# Altium schematic sheet Power_main_DCDC.SchDoc: =DocumentName
size A3; DocumentNumber: 1; Revision: 0; SheetNumber: 4; SheetTotal: 20; Last modified by: Krzysztof Belewicz
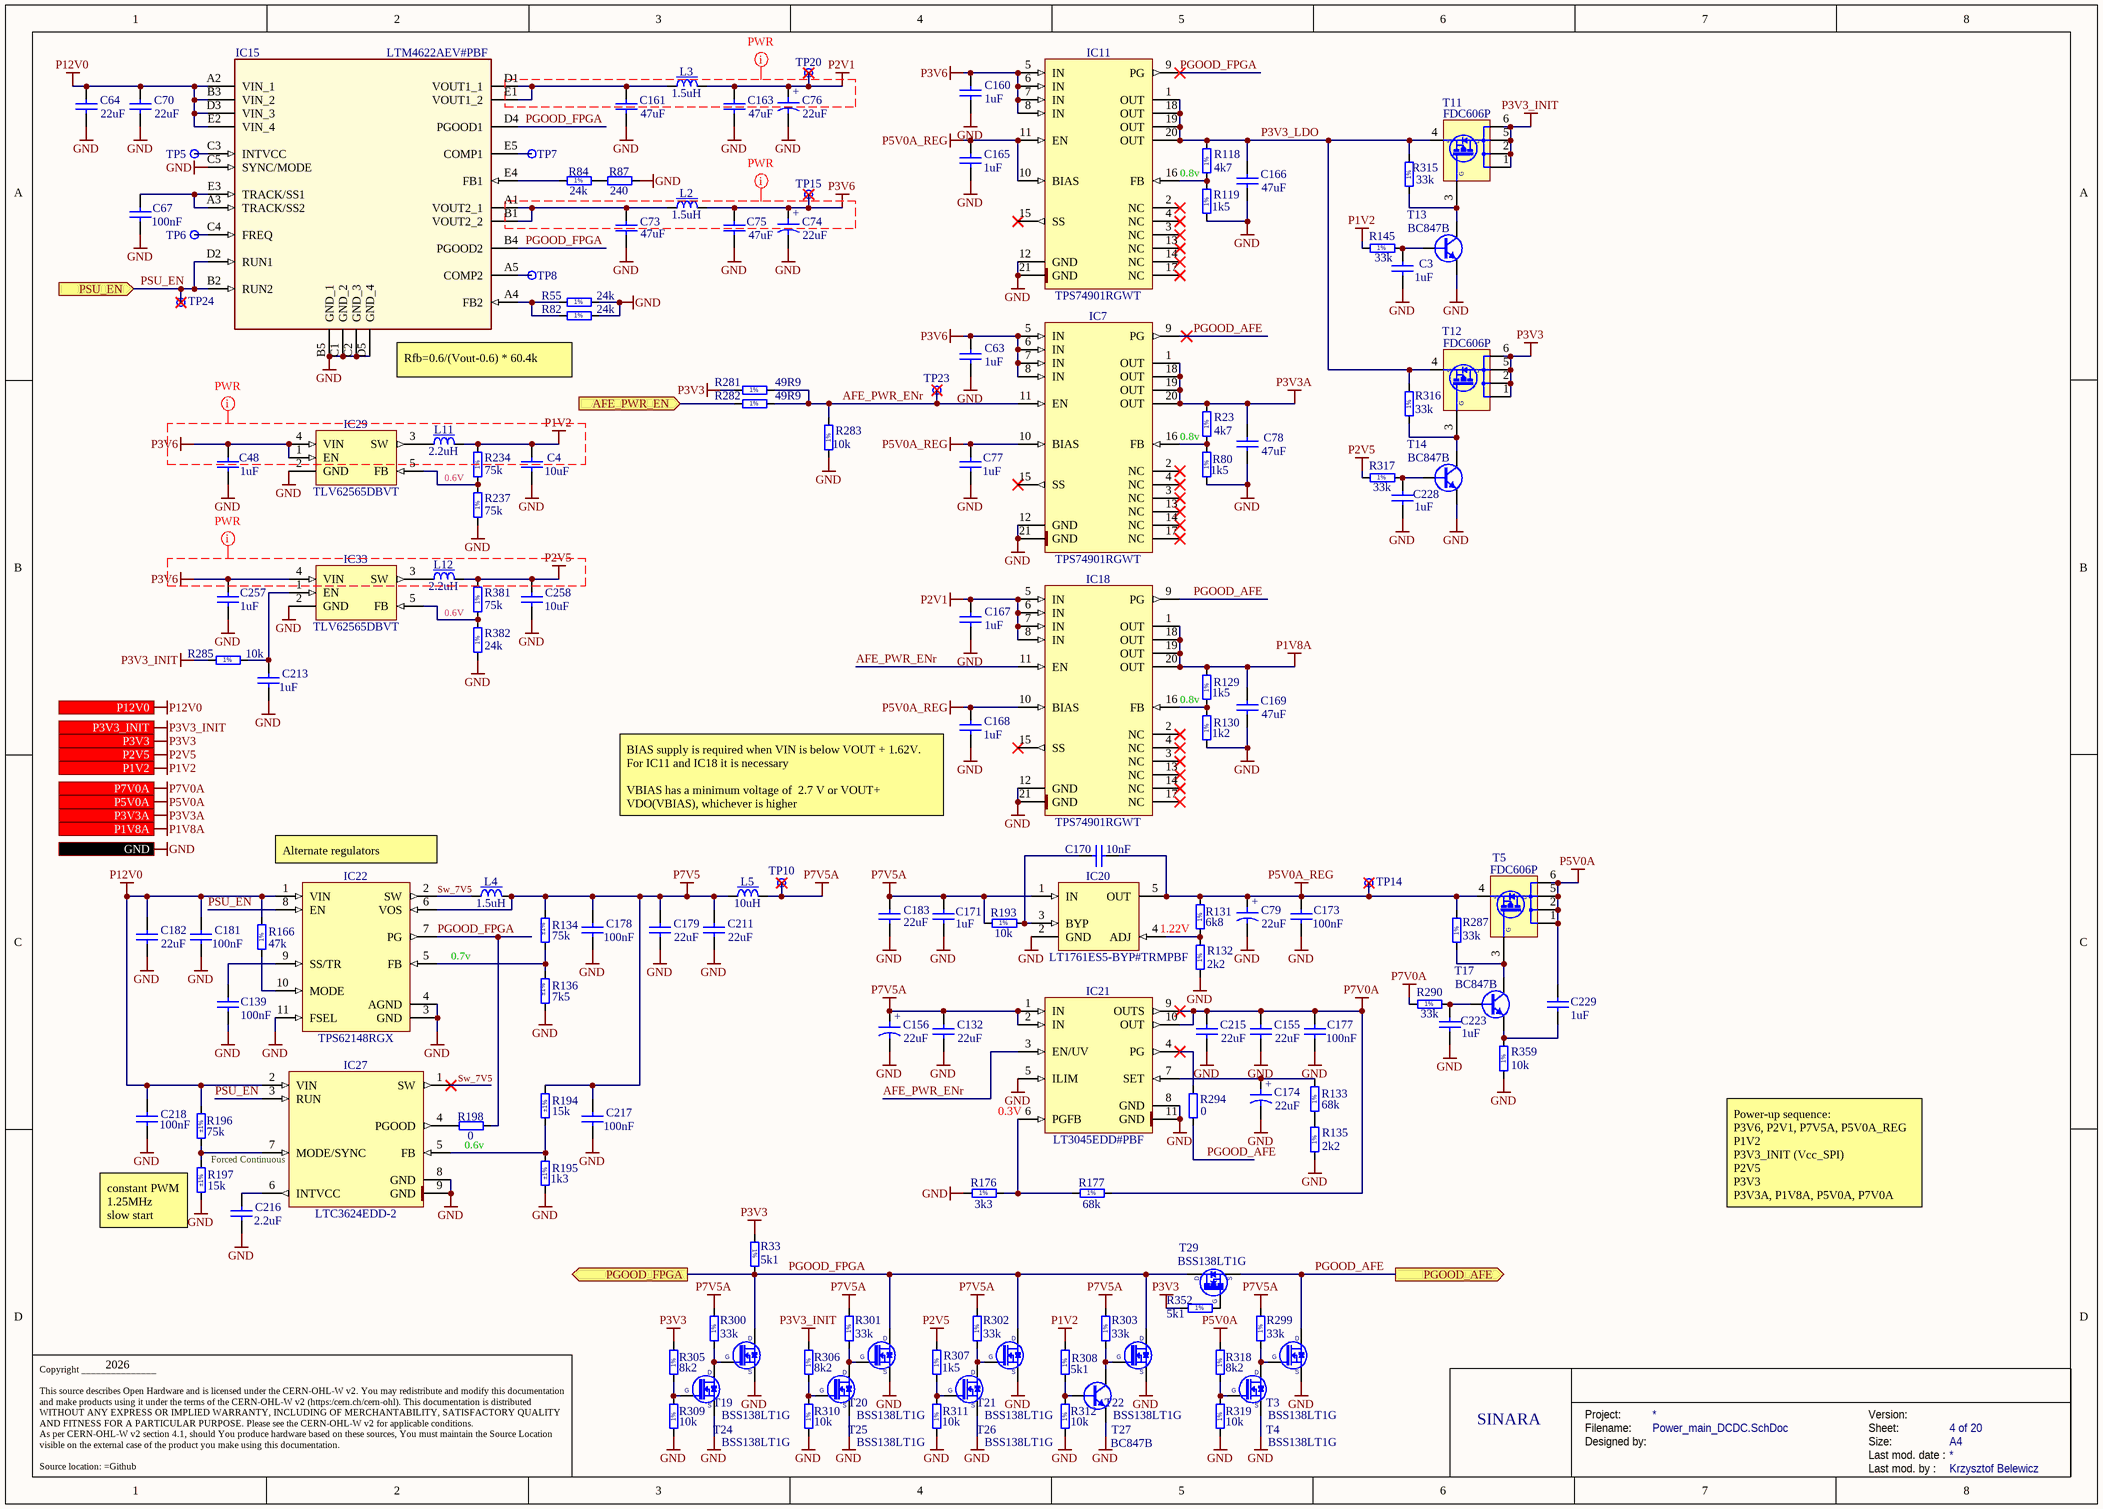
[diagram p0: Power_main_DCDC.SchDoc]

## Parts
C3  1uF  [CAPC1608X87N]
C4  10uF  [CAPC2012X135N]
C48  1uF  [CAPC1005X55N]
C63  1uF  [CAPC1005X55N]
C64  22uF  [CAPC2012X135N]
C67  100nF  [CAPC1005X55N]
C70  22uF  [CAPC2012X135N]
C73  47uF  [CAPC3225X270N]
C74  22uF  [CAPMP3528X210N]
C75  47uF  [CAPC3225X270N]
C76  22uF  [CAPMP3528X210N]
C77  1uF  [CAPC1005X55N]
C78  47uF  [CAPC3225X270N]
C79  22uF  [CAPMP3528X210N]
C132  22uF  [CAPC2012X135N]
C139  100nF  [CAPC1005X55N]
C155  22uF  [CAPC2012X135N]
C156  22uF  [CAPMP3528X210N]
C160  1uF  [CAPC1005X55N]
C161  47uF  [CAPC3225X270N]
C163  47uF  [CAPC3225X270N]
C165  1uF  [CAPC1005X55N]
C166  47uF  [CAPC3225X270N]
C167  1uF  [CAPC1005X55N]
C168  1uF  [CAPC1005X55N]
C169  47uF  [CAPC3225X270N]
C170  10nF  [CAPC1005X55N]
C171  1uF  [CAPC1005X55N]
C173  100nF  [CAPC1005X55N]
C174  22uF  [CAPMP3528X210N]
C177  100nF  [CAPC1005X55N]
C178  100nF  [CAPC1005X55N]
C179  22uF  [CAPC2012X135N]
C181  100nF  [CAPC1005X55N]
C182  22uF  [CAPC2012X135N]
C183  22uF  [CAPC2012X135N]
C211  22uF  [CAPC2012X135N]
C213  1uF  [CAPC1608X87N]
C215  22uF  [CAPC2012X135N]
C216  2.2uF  [CAPC1005X55N]
C217  100nF  [CAPC1005X55N]
C218  100nF  [CAPC1005X55N]
C223  1uF  [CAPC1608X87N]
C228  1uF  [CAPC1608X87N]
C229  1uF  [CAPC1005X55N]
C257  1uF  [CAPC1005X55N]
C258  10uF  [CAPC2012X135N]
IC7  TPS74901RGWT  [QFN65P500X500X100-21N-S325]
IC11  TPS74901RGWT  [QFN65P500X500X100-21N-S325]
IC15  LTM4622AEV#PBF  [LGA25C127P5X5_625X625X190]
IC18  TPS74901RGWT  [QFN65P500X500X100-21N-S325]
IC20  LT1761ES5-BYP#TRMPBF  [SOT95P280X100-5N]
IC21  LT3045EDD#PBF  [SON50P300X300X80-11N-R175X248]
IC22  TPS62148RGX  [TEXAS_RGX0011A]
IC27  LTC3624EDD-2  [SON50P300X300X80-9N-R175X248]
IC29  TLV62565DBVT  [SOT95P280X145-5N]
IC33  TLV62565DBVT  [SOT95P280X145-5N]
L2  1.5uH  [IND_TDK_SPM6530]
L3  1.5uH  [IND_TDK_SPM6530]
L4  1.5uH  [IND_TDK_SPM6530]
L5  10uH  [IND_MURATA-PS_8400]
L11  2.2uH  [IND_MURATA_LQH44PN_P0]
L12  2.2uH  [IND_MURATA_LQH44PN_P0]
R23  4k7  [RESC1005X40N]
R33  5k1  [RESC1005X40N]
R55  24k  [RESC1005X40N]
R80  1k5  [RESC1608X55N]
R82  24k  [RESC1005X40N]
R84  24k  [RESC1005X40N]
R87  240  [RESC1005X40N]
R118  4k7  [RESC1005X40N]
R119  1k5  [RESC1608X55N]
R129  1k5  [RESC1608X55N]
R130  1k2  [RESC1608X55N]
R131  6k8  [RESC1608X55N]
R132  2k2  [RESC1005X40N]
R133  68k  [RESC1005X40N]
R134  75k  Tolerance: ±1%  [RESC1608X55N]
R135  2k2  [RESC1005X40N]
R136  7k5  Tolerance: ±1%  [RESC1608X55N]
R145  33k  [RESC1005X40N]
R166  47k  [RESC1608X55N]
R176  3k3  [RESC1608X55N]
R177  68k  [RESC1005X40N]
R193  10k  [RESC1005X40N]
R194  15k  Tolerance: ±1%  [RESC1005X40N]
R195  1k3  Tolerance: ±1%  [RESC1005X40N]
R196  75k  Tolerance: ±1%  [RESC1005X40N]
R197  15k  Tolerance: ±1%  [RESC1005X40N]
R198  0  [RESC1005X40N]
R234  75k  [RESC1005X40N]
R237  75k  [RESC1005X40N]
R281  49R9  [RESC1005X40N]
R282  49R9  [RESC1005X40N]
R283  10k  [RESC1005X40N]
R285  10k  [RESC1005X40N]
R287  33k  [RESC1005X40N]
R290  33k  [RESC1005X40N]
R294  0  [RESC1005X40N]
R299  33k  [RESC1005X40N]
R300  33k  [RESC1005X40N]
R301  33k  [RESC1005X40N]
R302  33k  [RESC1005X40N]
R303  33k  [RESC1005X40N]
R305  8k2  [RESC1005X40N]
R306  8k2  [RESC1005X40N]
R307  1k5  [RESC1608X55N]
R308  5k1  [RESC1005X40N]
R309  10k  [RESC1005X40N]
R310  10k  [RESC1005X40N]
R311  10k  [RESC1005X40N]
R312  10k  [RESC1005X40N]
R315  33k  [RESC1005X40N]
R316  33k  [RESC1005X40N]
R317  33k  [RESC1005X40N]
R318  8k2  [RESC1005X40N]
R319  10k  [RESC1005X40N]
R352  5k1  [RESC1005X40N]
R359  10k  [RESC1005X40N]
R381  75k  [RESC1005X40N]
R382  24k  [RESC1005X40N]
T3  BSS138LT1G  [SOT95P240X110-3N]
T4  BSS138LT1G  [SOT95P240X110-3N]
T5  FDC606P  [SOT95P275X110-6N]
T11  FDC606P  [SOT95P275X110-6N]
T12  FDC606P  [SOT95P275X110-6N]
T13  BC847B  [SOT95P230X110-3N]
T14  BC847B  [SOT95P230X110-3N]
T17  BC847B  [SOT95P230X110-3N]
T19  BSS138LT1G  [SOT95P240X110-3N]
T20  BSS138LT1G  [SOT95P240X110-3N]
T21  BSS138LT1G  [SOT95P240X110-3N]
T22  BSS138LT1G  [SOT95P240X110-3N]
T24  BSS138LT1G  [SOT95P240X110-3N]
T25  BSS138LT1G  [SOT95P240X110-3N]
T26  BSS138LT1G  [SOT95P240X110-3N]
T27  BC847B  [SOT95P230X110-3N]
T29  BSS138LT1G  [SOT95P240X110-3N]
TP5  Test Point  [TPS127]  (value not drawn)  (no BOM)
TP6  Test Point  [TPS127]  (value not drawn)  (no BOM)
TP7  Test Point  [TPS127]  (value not drawn)  (no BOM)
TP8  Test Point  [TPS127]  (value not drawn)  (no BOM)
TP10  Test Point  [TPS127]  (value not drawn)  (no BOM)
TP14  Test Point  [TPS127]  (value not drawn)  (no BOM)
TP15  Test Point  [TPS127]  (value not drawn)  (no BOM)
TP20  Test Point  [TPS127]  (value not drawn)  (no BOM)
TP23  Test Point  [TPS127]  (value not drawn)  (no BOM)
TP24  Test Point  [TPS127]  (value not drawn)  (no BOM)

## Ports
AFE_PWR_EN (in), GND, P1V2 (out), P1V8A (out), P2V5 (out), P3V3 (out), P3V3_INIT (out), P3V3A (out), P5V0A (out), P7V0A (out), P12V0 (in), PGOOD_AFE (out), PGOOD_FPGA (out), PSU_EN (in)

## Nets
GND: C3.1 C4.2 C48.1 C63.2 C64.1 C67.1 C70.1 C73.1 C74.2 C75.1 C76.2 C77.1 C78.1 C79.2 C132.1 C139.2 C155.1 C156.2 C160.2 C161.1 C163.1 C165.1 C166.1 C167.2 C168.1 C169.1 C171.1 C173.1 C174.2 C177.1 C178.1 C179.1 C181.1 C182.1 C183.1 C211.1 C213.1 C215.1 C216.1 C217.1 C218.1 C223.1 C228.1 C257.1 C258.2 IC7.12(GND) IC7.21(GND) IC11.12(GND) IC11.21(GND) IC15.B5(GND_1) IC15.C1(GND_2) IC15.C2(GND_3) IC15.C5(SYNC/MODE) IC15.D5(GND_4) IC18.12(GND) IC18.21(GND) IC20.2(GND) IC21.5(ILIM) IC21.8(GND) IC21.11(GND) IC22.3(GND) IC22.4(AGND) IC22.11(FSEL) IC27.8(GND) IC27.9(GND) IC29.2(GND) IC33.2(GND) R55.2 R80.1 R82.2 R87.1 R119.1 R130.1 R132.1 R135.1 R136.1 R176.1 R195.1 R197.1 R237.1 R283.1 R309.1 R310.1 R311.1 R312.1 R319.1 R359.1 R382.1 T3.2(S) T4.2(S) T13.2(E) T14.2(E) T19.2(S) T20.2(S) T21.2(S) T22.2(S) T24.2(S) T25.2(S) T26.2(S) T27.2(E) ; port GND
P1V2: C4.1 L11.2 R145.1 R234.2 R308.2 ; port P1V2
P1V8A: C169.2 IC18.1(OUT) IC18.18(OUT) IC18.19(OUT) IC18.20(OUT) R129.2 ; port P1V8A
P2V1: C76.1 C163.2 C167.1 IC18.5(IN) IC18.6(IN) IC18.7(IN) IC18.8(IN) L3.2 TP20.1
P2V5: C258.1 L12.2 R307.2 R317.1 R381.2 ; port P2V5
P3V3: R33.1 R281.1 R305.2 R352.1 T12.1(D) T12.2(D) T12.5(D) T12.6(D) ; port P3V3
P3V3_INIT: R285.1 R306.2 T11.1(D) T11.2(D) T11.5(D) T11.6(D) ; port P3V3_INIT
P3V3A: C78.2 IC7.1(OUT) IC7.18(OUT) IC7.19(OUT) IC7.20(OUT) R23.2 ; port P3V3A
P3V6: C48.2 C63.1 C74.1 C75.2 C160.1 C257.2 IC7.5(IN) IC7.6(IN) IC7.7(IN) IC7.8(IN) IC11.5(IN) IC11.6(IN) IC11.7(IN) IC11.8(IN) IC29.1(EN) IC29.4(VIN) IC33.4(VIN) L2.2 TP15.1
P5V0A: C229.1 R318.2 T5.1(D) T5.2(D) T5.5(D) T5.6(D) ; port P5V0A
P5V0A_REG: C77.2 C79.1 C165.2 C168.2 C170.2 C173.2 IC7.10(BIAS) IC11.10(BIAS) IC11.11(EN) IC18.10(BIAS) IC20.5(OUT) R131.2 R287.2 T5.4(S) TP14.1
P7V0A: C155.2 C177.2 C215.2 IC21.9(OUTS) IC21.10(OUT) R177.2 R290.1 ; port P7V0A
P7V5: C178.2 C179.2 C211.2 C217.2 IC22.6(VOS) L4.2 L5.1 R134.2 R194.2
P7V5A: C132.2 C156.1 C171.2 C183.2 IC20.1(IN) IC21.1(IN) IC21.2(IN) L5.2 R193.1 R299.2 R300.2 R301.2 R302.2 R303.2 TP10.1
P12V0: C64.2 C70.2 C181.2 C182.2 C218.2 IC15.A2(VIN_1) IC15.B3(VIN_2) IC15.D3(VIN_3) IC15.E2(VIN_4) IC22.1(VIN) IC27.2(VIN) R166.2 R196.2 ; port P12V0
AFE_PWR_EN: R282.1 ; port AFE_PWR_EN
AFE_PWR_ENr: IC7.11(EN) IC18.11(EN) IC21.3(EN/UV) R281.2 R282.2 R283.2 TP23.1
P3V3_LDO: C166.2 IC11.1(OUT) IC11.18(OUT) IC11.19(OUT) IC11.20(OUT) R118.2 R315.2 R316.2 T11.4(S) T12.4(S)
PGOOD_AFE: IC7.9(PG) IC18.9(PG) R294.1 T3.3(D) T29.2(S) ; port PGOOD_AFE
PGOOD_FPGA: IC11.9(PG) IC15.B4(PGOOD2) IC15.D4(PGOOD1) IC22.7(PG) R33.2 R198.2 T19.3(D) T20.3(D) T21.3(D) T22.3(D) T29.3(D) ; port PGOOD_FPGA
PSU_EN: IC15.B2(RUN2) IC15.D2(RUN1) IC22.8(EN) IC27.3(RUN) TP24.1 ; port PSU_EN
Sw_7V5: IC22.2(SW) IC27.1(SW) L4.1
NetC3_2: C3.2 R145.2 T13.1(B)
NetC67_2: C67.2 IC15.A3(TRACK/SS2) IC15.E3(TRACK/SS1)
NetC73_2: C73.2 IC15.A1(VOUT2_1) IC15.B1(VOUT2_2) L2.1
NetC139_1: C139.1 IC22.9(SS/TR)
NetC161_2: C161.2 IC15.D1(VOUT1_1) IC15.E1(VOUT1_2) L3.1
NetC170_1: C170.1 IC20.3(BYP) R193.2
NetC174_1: C174.1 IC21.7(SET) R133.2
NetC213_2: C213.2 IC33.1(EN) R285.2
NetC216_2: C216.2 IC27.6(INTVCC)
NetC223_2: C223.2 R290.2 T17.1(B)
NetC228_2: C228.2 R317.2 T14.1(B)
NetC229_2: C229.2 R359.2 T17.2(E)
NetIC7_16: IC7.16(FB) R23.1 R80.2
NetIC11_16: IC11.16(FB) R118.1 R119.2
NetIC15_A4: IC15.A4(FB2) R55.1 R82.1
NetIC15_A5: IC15.A5(COMP2) TP8.1
NetIC15_C3: IC15.C3(INTVCC) TP5.1
NetIC15_C4: IC15.C4(FREQ) TP6.1
NetIC15_E4: IC15.E4(FB1) R84.1
NetIC15_E5: IC15.E5(COMP1) TP7.1
NetIC18_16: IC18.16(FB) R129.1 R130.2
NetIC20_4: IC20.4(ADJ) R131.1 R132.2
NetIC21_4: IC21.4(PG) R294.2
NetIC21_6: IC21.6(PGFB) R176.2 R177.1
NetIC22_5: IC22.5(FB) R134.1 R136.2
NetIC22_10: IC22.10(MODE) R166.1
NetIC27_4: IC27.4(PGOOD) R198.1
NetIC27_5: IC27.5(FB) R194.1 R195.2
NetIC27_7: IC27.7(MODE/SYNC) R196.1 R197.2
NetIC29_3: IC29.3(SW) L11.1
NetIC29_5: IC29.5(FB) R234.1 R237.2
NetIC33_3: IC33.3(SW) L12.1
NetIC33_5: IC33.5(FB) R381.1 R382.2
NetR84_2: R84.2 R87.2
NetR133_1: R133.1 R135.2
NetR287_1: R287.1 T5.3(S) T17.3(C)
NetR299_1: R299.1 T3.1(G) T4.3(D)
NetR300_1: R300.1 T19.1(G) T24.3(D)
NetR301_1: R301.1 T20.1(G) T25.3(D)
NetR302_1: R302.1 T21.1(G) T26.3(D)
NetR303_1: R303.1 T22.1(G) T27.3(C)
NetR305_1: R305.1 R309.2 T24.1(G)
NetR306_1: R306.1 R310.2 T25.1(G)
NetR307_1: R307.1 R311.2 T26.1(G)
NetR308_1: R308.1 R312.2 T27.1(B)
NetR315_1: R315.1 T11.3(S) T13.3(C)
NetR316_1: R316.1 T12.3(S) T14.3(C)
NetR318_1: R318.1 R319.2 T4.1(G)
NetR352_2: R352.2 T29.1(G)

Not connected (* = marked no-connect by the designer): IC7 2(NC)* 3(NC)* 4(NC)* 13(NC)* 14(NC)* 15(SS)* 17(NC)*; IC11 2(NC)* 3(NC)* 4(NC)* 13(NC)* 14(NC)* 15(SS)* 17(NC)*; IC18 2(NC)* 3(NC)* 4(NC)* 13(NC)* 14(NC)* 15(SS)* 17(NC)*

## Layout directives
net class PWR: P1V2, P2V1, P2V5, P3V6

## Notes on the sheet
- 0.8v
- (near IC15) Rfb=0.6/(Vout-0.6) * 60.4k
- 0.6V
- (near IC22) Alternate regulators
- (near C168) BIAS supply is required when VIN is below VOUT + 1.62V.
  For IC11 and IC18 it is necessary
  VBIAS has a minimum voltage of  2.7 V or VOUT+ VDO(VBIAS), whichever is higher
- 0.7v
- 1.22V
- (near IC21) 0.3V
- (near IC27) Forced Continuous
- (near R198) 0.6v
- (near R197) constant PWM
  1.25MHz
  slow start
- Power-up sequence:
  P3V6, P2V1, P7V5A, P5V0A_REG
  P1V2
  P3V3_INIT (Vcc_SPI)
  P2V5
  P3V3
  P3V3A, P1V8A, P5V0A, P7V0A
- 2026
- SINARA
- Project:
- Designed by:
- Filename:
- Size:
- Version:
- Last mod. date :
- Sheet:
- A4
- Copyright _______________
  This source describes Open Hardware and is licensed under the CERN-OHL-W v2. You may redistribute and modify this documentation and make products using it under the terms of the CERN-OHL-W v2 (https:/cern.ch/cern-ohl). This documentation is distributed WITHOUT ANY EXPRESS OR IMPLIED WARRANTY, INCLUDING OF MERCHANTABILITY, SATISFACTORY QUALITY AND FITNESS FOR A PARTICULAR PURPOSE. Please see the CERN-OHL-W v2 for applicable conditions.
  As per CERN-OHL-W v2 section 4.1, should You produce hardware based on these sources, You must maintain the Source Location visible on the external case of the product you make using this documentation.
  Source location: =Github
- Last mod. by :
- (in symbol CTE3528-21_22UF_10V_10%_LESR0700) +
- (in symbol FDC606P) G
- (in symbol R0402_2K2_1%_0.0625W_100PPM) 1%
- (in symbol R0402_4K7_1%_0.0625W_100PPM) 1%
- (in symbol R0402_5K1_1%_0.0625W_100PPM) 1%
- (in symbol R0402_8K2_1%_0.0625W_100PPM) 1%
- (in symbol R0402_10K_1%_0.0625W_100PPM) 1%
- (in symbol R0402_24K_1%_0.0625W_100PPM) 1%
- (in symbol R0402_33K_1%_0.0625W_100PPM) 1%
- (in symbol R0402_49R9_1%_0.0625W_100PPM) 1%
- (in symbol R0402_68K_1%_0.0625W_100PPM) 1%
- (in symbol R0402_75K_1%_0.0625W_100PPM) 1%
- (in symbol R0603_1K2_1%_0.1W_100PPM) 1%
- (in symbol R0603_1K5_1%_0.1W_100PPM) 1%
- (in symbol R0603_3K3_1%_0.1W_100PPM) 1%
- (in symbol R0603_6K8_1%_0.1W_100PPM) 1%
- (in symbol R0603_47K_1%_0.1W_100PPM) 1%

## Library data of the parts
C3 C213 C223 C228 = CC0603_1UF_25V_10%_X7R: Non-polarised capacitor; Part Description: SMD Multilayer Chip Ceramic Capacitor; Manufacturer: GENERIC; Manufacturer1 Part Number: GRM188R71E105KA12D; Voltage: 25V; TC: X7R; Tolerance: ±10%; Part Number: CC0603_1UF_25V_10%_X7R; Component Kind: Standard; Component Type: Standard; Pin Count: 2; Value: 1uF; Status: None; Manufacturer Part Number: CC0603_1UF_25V_10%_X7R; Case: 0603; Mounted: Yes; Socket: No; SMD: Yes; Sense: No; Manufacturer1 Example: MURATA; Manufacturer1 ComponentHeight: 0.9mm; HelpURL: \\cern.ch\dfs\Applications\Altium\Datasheets\CC0603_X7R_MURATA.pdf; Author: CERN DEM JLC; CreateDate: 18.01.2011; LatestRevisionDate: 18.01.2011
C4 C258 = CC0805_10UF_16V_10%_X5R: Non-polarised capacitor; Part Description: SMD Multilayer Chip Ceramic Capacitor; Manufacturer: GENERIC; Manufacturer1 Part Number: C0805C106K4PAC; Voltage: 16V; TC: X5R; Tolerance: ±10%; Part Number: CC0805_10UF_16V_10%_X5R; Component Kind: Standard; Component Type: Standard; Pin Count: 2; Value: 10uF; Status: Preferred; Manufacturer Part Number: CC0805_10UF_16V_10%_X5R; Case: 0805; Mounted: Yes; Socket: No; SMD: Yes; Manufacturer1 Example: KEMET; Manufacturer1 ComponentHeight: 1.4mm; HelpURL: \\cern.ch\dfs\Applications\Altium\Datasheets\CC1206_X5R_KEMET.pdf; Author: CERN DEM JLC; CreateDate: 03.12.2007; LatestRevisionDate: 03.12.2007; Sense: No
C48 C63 C77 C160 C165 C167 C168 C171 C229 C257 = CC0402_1UF_16V_10%_X5R: Non-polarised capacitor; Part Description: SMD Multilayer Chip Ceramic Capacitor; Manufacturer: GENERIC; Manufacturer1 Part Number: C1005X5R1C105KT; Voltage: 16V; TC: X5R; Tolerance: ±10%; Part Number: CC0402_1UF_16V_10%_X5R; Component Kind: Standard; Component Type: Standard; Pin Count: 2; Value: 1uF; Status: Preferred; Manufacturer Part Number: CC0402_1UF_16V_10%_X5R; Case: 0402; Mounted: Yes; Socket: No; SMD: Yes; Sense: No; Manufacturer1 Example: TDK; Manufacturer1 ComponentHeight: 0.55mm; HelpURL: \\cern.ch\dfs\Applications\Altium\Datasheets\CC0402_X5R_TDK_C.pdf; Author: CERN DEM JLC
  C48 C171 C257: CreateDate: 25.10.2012; LatestRevisionDate: 25.10.2012
  C63 C77 C160 C165 C167 C168 C229: CreateDate: 2012-10-25; LatestRevisionDate: 2012-10-25
C64 C70 C132 C155 C179 C182 C183 C211 C215 = CC0805_22UF_16V_10%_X5R: Non-polarised capacitor; Part Description: SMD Multilayer Chip Ceramic Capacitor; Manufacturer: GENERIC; Manufacturer1 Part Number: C2012X5R1C226KT; Voltage: 16V; TC: X5R; Tolerance: ±10%; Part Number: CC0805_22UF_16V_10%_X5R; Component Kind: Standard; Component Type: Standard; Pin Count: 2; Value: 22uF; Status: Preferred; Manufacturer Part Number: CC0805_22UF_16V_10%_X5R; Case: 0805; Mounted: Yes; Socket: No; SMD: Yes; Sense: No; Manufacturer1 Example: TDK; Manufacturer1 ComponentHeight: 1.35mm; HelpURL: \\cern.ch\dfs\Applications\Altium\Datasheets\CC0805_X5R_TDK_C.pdf; Author: CERN DEM JLC; CreateDate: 25.10.2012; LatestRevisionDate: 25.10.2012
C67 C139 C173 C177 C178 C181 C217 C218 = CC0402_100NF_16V_10%_X5R: Non-polarised capacitor; Part Description: SMD Multilayer Chip Ceramic Capacitor; Manufacturer: GENERIC; Manufacturer1 Part Number: GRM155R61C104KA88D; Voltage: 16V; TC: X5R; Tolerance: ±10%; Part Number: CC0402_100NF_16V_10%_X5R; Component Kind: Standard; Component Type: Standard; Pin Count: 2; Value: 100nF; Status: None; Manufacturer Part Number: CC0402_100NF_16V_10%_X5R; Case: 0402; Mounted: Yes; Socket: No; SMD: Yes; Sense: No; Manufacturer1 Example: MURATA; Manufacturer1 ComponentHeight: 0.55mm; HelpURL: \\cern.ch\dfs\Applications\Altium\Datasheets\CC0402_X5R_MURATA_GRM.pdf; Author: CERN DEM JLC; CreateDate: 10.12.2013; LatestRevisionDate: 10.12.2013
C73 C75 C78 C161 C163 C166 C169 = CC1210_47UF_10V_20%_X5R: Non-polarised capacitor; Part Description: SMD Multilayer Chip Ceramic Capacitor; Manufacturer: GENERIC; Manufacturer1 Part Number: LMK325BJ476MM-T; Voltage: 10V; TC: X5R; Tolerance: ±20%; Part Number: CC1210_47UF_10V_20%_X5R; Component Kind: Standard; Component Type: Standard; Pin Count: 2; Value: 47uF; Status: None; Manufacturer Part Number: CC1210_47UF_10V_20%_X5R; Case: 1210; Mounted: Yes; Socket: No; SMD: Yes; Sense: No; Manufacturer1 Example: TAIYO YUDEN; Manufacturer1 ComponentHeight: 2.7mm; HelpURL: \\cern.ch\dfs\Applications\Altium\Datasheets\CC1210_X5R_TAIYO-YUDEN_HIGH-VALUE.pdf; Author: CERN DEM JLC; CreateDate: 04.05.2011; LatestRevisionDate: 04.05.2011
C74 C76 C79 C156 C174 = CTE3528-21_22UF_10V_10%_LESR0700: Polarised capacitor; Part Description: Low ESR 0R7 Solid Tantalum Chip Capacitor; Manufacturer: GENERIC; Manufacturer1 Part Number: TPSB226K010R0700; Voltage: 10V; Tolerance: ±10%; Part Number: CTE3528-21_22UF_10V_10%_LESR0700; Component Kind: Standard; Component Type: Standard; Pin Count: 2; Value: 22uF; Status: Preferred; Manufacturer Part Number: CTE3528-21_22UF_10V_10%_LESR0700; Case: B; Mounted: Yes; Socket: No; SMD: Yes; Sense: No; Manufacturer1 Example: AVX; Manufacturer1 ComponentHeight: 2.1mm; HelpURL: \\cern.ch\dfs\Applications\Altium\Datasheets\CTE-LESR_AVX_TPS.pdf; Author: CERN DEM JLC; CreateDate: 05.05.2008; LatestRevisionDate: 20.01.2009
C170 = CC0402_10NF_16V_10%_X7R: Non-polarised capacitor; Part Description: SMD Multilayer Chip Ceramic Capacitor; Manufacturer: GENERIC; Manufacturer1 Part Number: 223878715636; Voltage: 16V; TC: X7R; Tolerance: ±10%; Part Number: CC0402_10NF_16V_10%_X7R; Component Kind: Standard; Component Type: Standard; Pin Count: 2; Value: 10nF; Status: Not Recommended; Manufacturer Part Number: CC0402_10NF_16V_10%_X7R; Case: 0402; Mounted: Yes; Socket: No; SMD: Yes; Sense: No; Manufacturer1 Example: PHYCOMP; Manufacturer1 ComponentHeight: 0.55mm; HelpURL: \\cern.ch\dfs\Applications\Altium\Datasheets\CC0402_X7R_PHYCOMP.pdf; Author: CERN DEM JLC; CreateDate: 03.12.2007; LatestRevisionDate: 03.12.2007
C216 = CC0402_2.2UF_16V_10%_X5R: Non-polarised capacitor; Part Description: SMD Multilayer Chip Ceramic Capacitor; Manufacturer: GENERIC; Manufacturer1 Part Number: C1005X5R1C225K050; Voltage: 16V; TC: X5R; Tolerance: ±10%; Part Number: CC0402_2.2UF_16V_10%_X5R; Component Kind: Standard; Component Type: Standard; Pin Count: 2; Value: 2.2uF; Status: Preferred; Manufacturer Part Number: CC0402_2.2UF_16V_10%_X5R; Case: 0402; Mounted: Yes; Socket: No; SMD: Yes; Sense: No; Manufacturer1 Example: TDK; Manufacturer1 ComponentHeight: 0.55mm; HelpURL: \\cern.ch\dfs\Applications\Altium\Datasheets\CC0402_X5R_TDK_C.pdf; Author: CERN DEM BC; CreateDate: 08.02.2021; LatestRevisionDate: 08.02.2021
IC7 IC11 IC18 = TPS74901RGWT: 3A, 0.8 to 3.6V Adjustable Low-Dropout Linear Regulator with Programmable Soft-Start; Part Description: 0.8V to 3.6V, 3.0A Low Dropout Linear Regulator with Programmable Soft-Start; Manufacturer: TEXAS INSTRUMENTS; PressFit: No; Bonding: No; Part Number: TPS74901RGWT; Component Kind: Standard; Component Type: Standard; Device: TPS74901RGWT; PackageDescription: QFN, 0.65mm pitch,square; 20 pin, 5mm X 5mm X 1mm H body (w/thermal tab 3.25 X 3.25mm),  IPC Medium Density; Manufacturer Part Number: TPS74901RGWT; Pin Count: 21; Case: QFN20; Mounted: Yes; Socket: No; SMD: Yes; Sense: No; ComponentHeight: 1mm; HelpURL: \\cern.ch\dfs\Applications\Altium\Datasheets\TPS74901RGWT.pdf; Author: CERN DEM JLC; CreateDate: 07.03.2013; LatestRevisionDate: 07.03.2013
IC15 = PM_LTM4622: Dual Ultrathin 2A or Single 4A, 3.6V to 20V, 1.5V to 12V   Step-Down DC/DC μModule Regulator; Manufacturer: LINEAR TECHNOLOGY; PressFit: No; Bonding: No; Part Number: LTM4622AEV#PBF; Component Kind: Standard; Component Type: Standard; Device: LTM4622AEV#PBF; PackageDescription: LGA, 25-Leads, Body 6.25x6.25mmx1.90mm, Pitch 1.27mm; Part Description: Dual Ultrathin 2A or Single 4A, 3.6V to 20V, 1.5V to 12V   Step-Down DC/DC μModule Regulator; Manufacturer Part Number: LTM4622AEV#PBF; Pin Count: 25; Case: LGA25; Mounted: Yes; Socket: No; SMD: Yes; Sense: No; ComponentHeight: 2.92mm; HelpURL: \\cern.ch\dfs\Applications\Altium\Datasheets\LTM4619EV#PBF.pdf; Author: GK; CreateDate: 06.05.2010; LatestRevisionDate: 07.12.2011
IC20 = LT1761ES5-BYP#TRMPBF: 100mA, Low Noise, LDO Micropower Adjustable Regulator in SOT-23; Part Description: 1.22V to 20V, 100mA, Low Noise, LDO Adjustable Micropower Regulator; Manufacturer: LINEAR TECHNOLOGY; PressFit: No; Bonding: No; Part Number: LT1761ES5-BYP#TRMPBF; Component Kind: Standard; Component Type: Standard; Device: LT1761ES5-BYP#TRMPBF; PackageDescription: SOT23, 0.95mm pitch; 5 pin, 1.6mm W X 2.9mm L, IPC Medium Density; Manufacturer Part Number: LT1761ES5-BYP#TRMPBF; Pin Count: 5; Case: SOT23; Mounted: Yes; Socket: No; SMD: Yes; Sense: No; ComponentHeight: 1mm; HelpURL: \\cern.ch\dfs\Applications\Altium\Datasheets\LT1761ES5-SD#TRMPBF.pdf; Author: CERN DEM MR; CreateDate: 17.02.2016; LatestRevisionDate: 17.02.2016
IC21 = LT3045EDD#PBF: 20V, 500mA, Ultralow Noise, Ultrahigh PSRR Linear Regulator; Manufacturer: LINEAR TECHNOLOGY; PressFit: No; Bonding: No; Part Number: LT3045EDD#PBF; Component Kind: Standard; Component Type: Standard; Device: LT3045EDD#PBF; PackageDescription: SON, 0.50mm Pitch, 10-pin, 3.00mm W  X 3.00mm L X 0.80mm Height, (w/thermal tab 1.75 X 2.48 mm), IPC Medium Density; Part Description: 20V, 500mA, Ultralow Noise, Ultrahigh PSRR Linear Regulator; Manufacturer Part Number: LT3045EDD#PBF; Pin Count: 11; Case: SON10; Mounted: Yes; Socket: No; SMD: Yes; Sense: No; ComponentHeight: 0.8mm; HelpURL: \\cern.ch\dfs\Applications\Altium\Datasheets\LT3045EDD#PBF.pdf; Author: CERN DEM JLC; CreateDate: 07.12.2016; LatestRevisionDate: 07.12.2016
IC22 = TPS62148RGX: 3V-17V 2A Step-Down Converter, High Accuracy, With DCS-Control; Manufacturer: TEXAS INSTRUMENTS; PressFit: No; Bonding: No; Part Number: TPS62148RGX; Component Kind: Standard; Component Type: Standard; Device: TPS62148RGX; PackageDescription: TEXAS Case Style (R-VQFN-HR-N11), 0.50mm Pitch, 11-pin, 2.00mm W X 3.00mm L X 1.00mm H Body; Part Description: 3V-17V 2A Step-Down Converter, High Accuracy, With DCS-Control; Manufacturer Part Number: TPS62148RGX; Pin Count: 11; Case: QFN14; Mounted: Yes; Socket: No; SMD: Yes; Sense: No; ComponentHeight: 1mm; HelpURL: \\cern.ch\dfs\Applications\Altium\Datasheets\TPS62148RGX.pdf; Author: CERN DEM MR; CreateDate: 08.02.2019; LatestRevisionDate: 08.02.2019
IC27 = LTC3624 _DD: Adjustable, 2A, Synchronous Step-Down Regulator with 3.5µA Quiescent Current; Manufacturer: LINEAR TECHNOLOGY; PressFit: No; Bonding: No; Part Number: LTC3624EDD-2; Component Kind: Standard; Component Type: Standard; Device: LTC3624EDD-2; PackageDescription: SON, (DFN) 0.50mm Pitch; 8 Pin, 3.00mm W X 3.00mm L X 0.80mm H body (w/Thermal Tab 1.75 X 2.48mm), IPC Medium Density; Part Description: Adjustable, 2A, Synchronous Step-Down Regulator with 3.5µA Quiescent Current; Manufacturer Part Number: LTC3624EDD-2; Pin Count: 9; Case: SON8; Mounted: Yes; Socket: No; SMD: Yes; Sense: No; ComponentHeight: 0.8mm; HelpURL: \\cern.ch\dfs\Applications\Altium\Datasheets\LTC3624.pdf; Author: CERN DEM HF; CreateDate: 18.05.2022; LatestRevisionDate: 18.05.2022
IC29 IC33 = TLV62565DBVT: 1.5A High Efficiency Step-Down Converter, Adjustable Output Voltage; Manufacturer: TEXAS INSTRUMENTS; PressFit: No; Bonding: No; Part Number: TLV62565DBVT; Component Kind: Standard; Component Type: Standard; Device: TLV62565DBVT; PackageDescription: SOT23, 0.95mm Pitch; 5 Pin, 1.60mm W X 2.90mm L X 1.45mm H body, IPC Medium Density; Part Description: 1.5A High Efficiency Step-Down Converter, Adjustable Output Voltage; Manufacturer Part Number: TLV62565DBV; Pin Count: 5; Case: SOT23-5; Mounted: Yes; Socket: No; SMD: Yes; Sense: No; ComponentHeight: 1.45mm; HelpURL: \\cern.ch\dfs\Applications\Altium\Datasheets\TLV62565DBVT.pdf; Author: CERN DEM JMW; CreateDate: 29.08.2016; LatestRevisionDate: 13.06.2022
L2-L4 = IND_1.5UH_20%_TDK_SPM6530: Inductor With Core; Part Description: SMD Inductor for Power Circuits (Wound Metal), SPM Series; Manufacturer: TDK; Manufacturer Part Number: SPM6530T-1R5M100; Power: 11A; Resistance: 0.0097R; Tolerance: ±20%; Part Number: IND_1.5UH_20%_TDK_SPM6530; Component Kind: Standard; Component Type: Standard; Pin Count: 2; Value: 1.5uH; Status: None; Mounted: Yes; Socket: No; SMD: Yes; Sense: No; ComponentHeight: 3mm; HelpURL: \\cern.ch\dfs\Applications\Altium\Datasheets\IND_TDK_SPM6530.pdf; Author: CERN DEM MR; CreateDate: 08.11.2016; LatestRevisionDate: 08.11.2016
L5 = IND_10UH_10%_MURATA-PS_8400: Inductor With Core; Part Description: Miniature Surface Mount Power Inductor (8400 Serie); Manufacturer: MURATA POWER SOLUTIONS; Manufacturer Part Number: 84103C; Power: 950mA; Resistance: 0.24R; Tolerance: ±10%; Part Number: IND_10UH_10%_MURATA-PS_8400; Component Kind: Standard; Component Type: Standard; Pin Count: 2; Value: 10uH; Status: None; Mounted: Yes; Socket: No; SMD: Yes; Sense: No; ComponentHeight: 2.9mm; HelpURL: \\cern.ch\dfs\Applications\Altium\Datasheets\IND_MURATA-PS_8400.pdf; Author: CERN DEM JLC; CreateDate: 02.07.2012; LatestRevisionDate: 02.07.2012
L11 L12 = IND_2.2UH_20%_MURATA_LQH44PN2R2MP0L: Inductor With Core; Part Description: Wire Wound Ferrite Inductor for Power Lines; Manufacturer: MURATA; Power: 1.8A; Resistance: 0R049; Tolerance: ±20%; Part Number: IND_2.2UH_20%_MURATA_LQH44PN2R2MP0L; Component Kind: Standard; Component Type: Standard; Pin Count: 2; Value: 2.2uH; Status: None; Manufacturer Part Number: LQH44PN2R2MP0L; Case: 4040; Mounted: Yes; Socket: No; SMD: Yes; Sense: No; ComponentHeight: 1.8mm; HelpURL: \\cern.ch\dfs\Applications\Altium\Datasheets\IND_MURATA_LQH44PN_P0.pdf; Author: CERN DEM JLC; CreateDate: 14.02.2018; LatestRevisionDate: 14.02.2018
R23 R118 = R0402_4K7_1%_0.0625W_100PPM: Resistor - 1%; Part Description: General Purpose Thick Film Chip Resistor; Manufacturer: GENERIC; Manufacturer1 Part Number: 232270674702L; TC: ±100ppm/°C; Part Number: R0402_4K7_1%_0.0625W_100PPM; Component Kind: Standard; Component Type: Standard; Pin Count: 2; Value: 4k7; Status: Not recommended; Power: 0.0625W; Tolerance: ±1%; Manufacturer Part Number: R0402_4K7_1%_0.0625W_100PPM; Case: 0402; Mounted: Yes; Sense: No; Socket: No; SMD: Yes; Manufacturer1 Example: YAGEO PHYCOMP; Manufacturer1 ComponentHeight: 0.4mm; HelpURL: \\cern.ch\dfs\Applications\Altium\Datasheets\R0402_Phycomp_RC0402.pdf; Author: CERN DEM JLC; CreateDate: 2007-12-03; LatestRevisionDate: 2012-10-17
R33 R308 R352 = R0402_5K1_1%_0.0625W_100PPM: Resistor - 1%; Part Description: General Purpose Thick Film Chip Resistor; Manufacturer: GENERIC; Manufacturer1 Part Number: 232270675102L; TC: ±100ppm/°C; PressFit: No; Part Number: R0402_5K1_1%_0.0625W_100PPM; Component Kind: Standard; Component Type: Standard; Pin Count: 2; Value: 5k1; Status: Not Recommended; Power: 0.0625W; Tolerance: ±1%; Manufacturer Part Number: R0402_5K1_1%_0.0625W_100PPM; Case: 0402; Mounted: Yes; Sense: No; Socket: No; SMD: Yes; Manufacturer1 Example: YAGEO PHYCOMP; Manufacturer1 ComponentHeight: 0.4mm; HelpURL: \\cern.ch\dfs\Applications\Altium\Datasheets\R0402_Phycomp_RC0402.pdf; Author: CERN DEM JLC; CreateDate: 03.12.2007; LatestRevisionDate: 17.10.2012
R55 R82 R84 R382 = R0402_24K_1%_0.0625W_100PPM: Resistor - 1%; Part Description: General Purpose Thick Film Chip Resistor; Manufacturer: GENERIC; Manufacturer1 Part Number: 232270672403L; TC: ±100ppm/°C; PressFit: No; Part Number: R0402_24K_1%_0.0625W_100PPM; Component Kind: Standard; Component Type: Standard; Pin Count: 2; Value: 24k; Status: Not Recommended; Power: 0.0625W; Tolerance: ±1%; Manufacturer Part Number: R0402_24K_1%_0.0625W_100PPM; Case: 0402; Mounted: Yes; Sense: No; Socket: No; SMD: Yes; Manufacturer1 Example: YAGEO PHYCOMP; Manufacturer1 ComponentHeight: 0.4mm; HelpURL: \\cern.ch\dfs\Applications\Altium\Datasheets\R0402_Phycomp_RC0402.pdf; Author: CERN DEM JLC; CreateDate: 03/12/2007; LatestRevisionDate: 17/10/2012
R80 R119 R307 = R0603_1K5_1%_0.1W_100PPM: Resistor - 1%; Part Description: General Purpose Thick Film Chip Resistor; Manufacturer: GENERIC; Manufacturer1 Part Number: NRC06F1501TRF; Power: 0.1W; TC: ±100ppm/°C; PressFit: No; Part Number: R0603_1K5_1%_0.1W_100PPM; Component Kind: Standard; Component Type: Standard; Pin Count: 2; Value: 1k5; Status: Preferred; Tolerance: ±1%; Manufacturer Part Number: R0603_1K5_1%_0.1W_100PPM; Case: 0603; Mounted: Yes; Sense: No; Socket: No; SMD: Yes; Manufacturer1 Example: NIC COMPONENT; Manufacturer1 ComponentHeight: 0.55mm; HelpURL: \\cern.ch\dfs\Applications\Altium\Datasheets\R0603_NIC_NRC.pdf; Author: CERN DEM JLC; CreateDate: 03.12.2007; LatestRevisionDate: 13.03.2008
R87 = R0402_240R_1%_0.0625W_100PPM: Resistor - 1%; Part Description: General Purpose Thick Film Chip Resistor; Manufacturer: GENERIC; Manufacturer1 Part Number: 232270672401L; TC: ±100ppm/°C; PressFit: No; Part Number: R0402_240R_1%_0.0625W_100PPM; Component Kind: Standard; Component Type: Standard; Pin Count: 2; Value: 240; Status: Not Recommended; Power: 0.0625W; Tolerance: ±1%; Manufacturer Part Number: R0402_240R_1%_0.0625W_100PPM; Case: 0402; Mounted: Yes; Sense: No; Socket: No; SMD: Yes; Manufacturer1 Example: YAGEO PHYCOMP; Manufacturer1 ComponentHeight: 0.4mm; HelpURL: \\cern.ch\dfs\Applications\Altium\Datasheets\R0402_Phycomp_RC0402.pdf; Author: CERN DEM JLC; CreateDate: 03.12.2007; LatestRevisionDate: 17.10.2012
R129 = R0603_1K5_1%_0.1W_100PPM: Resistor - 1%; Part Description: General Purpose Thick Film Chip Resistor; Manufacturer: GENERIC; Manufacturer1 Part Number: NRC06F1501TRF; Power: 0.1W; TC: ±100ppm/°C; Part Number: R0603_1K5_1%_0.1W_100PPM; Component Kind: Standard; Component Type: Standard; Pin Count: 2; Value: 1k5; Status: Preferred; Tolerance: ±1%; Manufacturer Part Number: R0603_1K5_1%_0.1W_100PPM; Case: 0603; Mounted: Yes; Sense: No; Socket: No; SMD: Yes; Manufacturer1 Example: NIC COMPONENT; Manufacturer1 ComponentHeight: 0.55mm; HelpURL: \\cern.ch\dfs\Applications\Altium\Datasheets\R0603_NIC_NRC.pdf; Author: CERN DEM JLC; CreateDate: 03.12.2007; LatestRevisionDate: 13.03.2008
R130 = R0603_1K2_1%_0.1W_100PPM: Resistor - 1%; Part Description: General Purpose Thick Film Chip Resistor; Manufacturer: GENERIC; Manufacturer1 Part Number: NRC06F1201TRF; Power: 0.1W; TC: ±100ppm/°C; Part Number: R0603_1K2_1%_0.1W_100PPM; Component Kind: Standard; Component Type: Standard; Pin Count: 2; Value: 1k2; Status: Preferred; Tolerance: ±1%; Manufacturer Part Number: R0603_1K2_1%_0.1W_100PPM; Case: 0603; Mounted: Yes; Sense: No; Socket: No; SMD: Yes; Manufacturer1 Example: NIC COMPONENT; Manufacturer1 ComponentHeight: 0.55mm; HelpURL: \\cern.ch\dfs\Applications\Altium\Datasheets\R0603_NIC_NRC.pdf; Author: CERN DEM JLC; CreateDate: 03.12.2007; LatestRevisionDate: 13.03.2008
R131 = R0603_6K8_1%_0.1W_100PPM: Resistor - 1%; Part Description: General Purpose Thick Film Chip Resistor; Manufacturer: GENERIC; Manufacturer1 Part Number: NRC06F6801TRF; Power: 0.1W; TC: ±100ppm/°C; Part Number: R0603_6K8_1%_0.1W_100PPM; Component Kind: Standard; Component Type: Standard; Pin Count: 2; Value: 6k8; Status: Preferred; Tolerance: ±1%; Manufacturer Part Number: R0603_6K8_1%_0.1W_100PPM; Case: 0603; Mounted: Yes; Sense: No; Socket: No; SMD: Yes; Manufacturer1 Example: NIC COMPONENT; Manufacturer1 ComponentHeight: 0.55mm; HelpURL: \\cern.ch\dfs\Applications\Altium\Datasheets\R0603_NIC_NRC.pdf; Author: CERN DEM JLC; CreateDate: 03.12.2007; LatestRevisionDate: 13.03.2008
R132 R135 = R0402_2K2_1%_0.0625W_100PPM: Resistor - 1%; Part Description: General Purpose Thick Film Chip Resistor; Manufacturer: GENERIC; Manufacturer1 Part Number: 232270672202L; TC: ±100ppm/°C; Table: Resistors SMD; Part Number: R0402_2K2_1%_0.0625W_100PPM; Component Kind: Standard; Component Type: Standard; Pin Count: 2; Value: 2k2; Status: Not recommended; Power: 0.0625W; Tolerance: ±1%; Manufacturer Part Number: R0402_2K2_1%_0.0625W_100PPM; Case: 0402; Mounted: Yes; Socket: No; SMD: Yes; Manufacturer1 Example: YAGEO PHYCOMP; Manufacturer1 ComponentHeight: 0.4mm; HelpURL: \\cern.ch\dfs\Applications\Altium\Datasheets\R0402_Phycomp_RC0402.pdf; Author: CERN DEM JLC; CreateDate: 2007-12-03; LatestRevisionDate: 2012-10-17
R133 R177 = R0402_68K_1%_0.0625W_100PPM: Resistor - 1%; Part Description: General Purpose Thick Film Chip Resistor; Manufacturer: GENERIC; Manufacturer1 Part Number: 232270676803L; TC: ±100ppm/°C; PressFit: No; Part Number: R0402_68K_1%_0.0625W_100PPM; Component Kind: Standard; Component Type: Standard; Pin Count: 2; Value: 68k; Status: Not Recommended; Power: 0.0625W; Tolerance: ±1%; Manufacturer Part Number: R0402_68K_1%_0.0625W_100PPM; Case: 0402; Mounted: Yes; Sense: No; Socket: No; SMD: Yes; Manufacturer1 Example: YAGEO PHYCOMP; Manufacturer1 ComponentHeight: 0.4mm; HelpURL: \\cern.ch\dfs\Applications\Altium\Datasheets\R0402_Phycomp_RC0402.pdf; Author: CERN DEM JLC; CreateDate: 03.12.2007; LatestRevisionDate: 17.10.2012
R134 = R0603_75K_1%_0.1W_100PPM: Resistor - 1%; Part Description: General Purpose Thick Film Chip Resistor; Manufacturer: GENERIC; Manufacturer1 Part Number: NRC06F7502TRF; Power: 0.1W; TC: ±100ppm/°C; PressFit: No; Part Number: R0603_75K_1%_0.1W_100PPM; Component Kind: Standard; Component Type: Standard; Pin Count: 2; Value: 75k; Status: Preferred; Manufacturer Part Number: R0603_75K_1%_0.1W_100PPM; Case: 0603; Mounted: Yes; Sense: No; Socket: No; SMD: Yes; Manufacturer1 Example: NIC COMPONENT; Manufacturer1 ComponentHeight: 0.55mm; HelpURL: \\cern.ch\dfs\Applications\Altium\Datasheets\R0603_NIC_NRC.pdf; Author: CERN DEM JLC; CreateDate: 03.12.2007; LatestRevisionDate: 13.03.2008
R136 = R0603_7k5_1%_0.1W_100PPM: Resistor - 1%; Part Description: General Purpose Thick Film Chip Resistor; Manufacturer: GENERIC; Manufacturer1 Part Number: NRC06F7501TRF; Power: 0.1W; TC: ±100ppm/°C; PressFit: No; Part Number: R0603_7K5_1%_0.1W_100PPM; Component Kind: Standard; Component Type: Standard; Pin Count: 2; Value: 7k5; Status: Preferred; Manufacturer Part Number: R0603_7K5_1%_0.1W_100PPM; Case: 0603; Mounted: Yes; Sense: No; Socket: No; SMD: Yes; Manufacturer1 Example: NIC COMPONENT; Manufacturer1 ComponentHeight: 0.55mm; HelpURL: \\cern.ch\dfs\Applications\Altium\Datasheets\R0603_NIC_NRC.pdf; Author: CERN DEM JLC; CreateDate: 03.12.2007; LatestRevisionDate: 13.03.2008
R145 R287 R290 R299-R303 R315-R317 = R0402_33K_1%_0.0625W_100PPM: Resistor - 1%; Part Description: General Purpose Thick Film Chip Resistor; Manufacturer: GENERIC; Manufacturer1 Part Number: 232270673303L; TC: ±100ppm/°C; PressFit: No; Part Number: R0402_33K_1%_0.0625W_100PPM; Component Kind: Standard; Component Type: Standard; Pin Count: 2; Value: 33k; Status: Not Recommended; Power: 0.0625W; Tolerance: ±1%; Manufacturer Part Number: R0402_33K_1%_0.0625W_100PPM; Case: 0402; Mounted: Yes; Sense: No; Socket: No; SMD: Yes; Manufacturer1 Example: YAGEO PHYCOMP; Manufacturer1 ComponentHeight: 0.4mm; HelpURL: \\cern.ch\dfs\Applications\Altium\Datasheets\R0402_Phycomp_RC0402.pdf; Author: CERN DEM JLC; CreateDate: 03.12.2007; LatestRevisionDate: 17.10.2012
R166 = R0603_47K_1%_0.1W_100PPM: Resistor - 1%; Part Description: General Purpose Thick Film Chip Resistor; Manufacturer: GENERIC; Manufacturer1 Part Number: NRC06F4702TRF; Power: 0.1W; TC: ±100ppm/°C; Part Number: R0603_47K_1%_0.1W_100PPM; Component Kind: Standard; Component Type: Standard; Pin Count: 2; Value: 47k; Status: Preferred; Tolerance: ±1%; Manufacturer Part Number: R0603_47K_1%_0.1W_100PPM; Case: 0603; Mounted: Yes; Sense: No; Socket: No; SMD: Yes; Manufacturer1 Example: NIC COMPONENT; Manufacturer1 ComponentHeight: 0.55mm; HelpURL: \\cern.ch\dfs\Applications\Altium\Datasheets\R0603_NIC_NRC.pdf; Author: CERN DEM JLC; CreateDate: 03.12.2007; LatestRevisionDate: 13.03.2008
R176 = R0603_3K3_1%_0.1W_100PPM: Resistor - 1%; Part Description: General Purpose Thick Film Chip Resistor; Manufacturer: GENERIC; Manufacturer1 Part Number: NRC06F3301TRF; Power: 0.1W; TC: ±100ppm/°C; PressFit: No; Part Number: R0603_3K3_1%_0.1W_100PPM; Component Kind: Standard; Component Type: Standard; Pin Count: 2; Value: 3k3; Status: Preferred; Tolerance: ±1%; Manufacturer Part Number: R0603_3K3_1%_0.1W_100PPM; Case: 0603; Mounted: Yes; Sense: No; Socket: No; SMD: Yes; Manufacturer1 Example: NIC COMPONENT; Manufacturer1 ComponentHeight: 0.55mm; HelpURL: \\cern.ch\dfs\Applications\Altium\Datasheets\R0603_NIC_NRC.pdf; Author: CERN DEM JLC; CreateDate: 03.12.2007; LatestRevisionDate: 13.03.2008
R193 R283 R285 R359 = R0402_10K_1%_0.0625W_100PPM: Resistor - 1%; Part Description: General Purpose Thick Film Chip Resistor; Manufacturer: GENERIC; Manufacturer1 Part Number: 232270671003L; TC: ±100ppm/°C; PressFit: No; Part Number: R0402_10K_1%_0.0625W_100PPM; Component Kind: Standard; Component Type: Standard; Pin Count: 2; Value: 10k; Status: Not Recommended; Power: 0.0625W; Tolerance: ±1%; Manufacturer Part Number: R0402_10K_1%_0.0625W_100PPM; Case: 0402; Mounted: Yes; Sense: No; Socket: No; SMD: Yes; Manufacturer1 Example: YAGEO PHYCOMP; Manufacturer1 ComponentHeight: 0.4mm; HelpURL: \\cern.ch\dfs\Applications\Altium\Datasheets\R0402_Phycomp_RC0402.pdf; Author: CERN DEM JLC; CreateDate: 03.12.2007; LatestRevisionDate: 17.10.2012
R194 R197 = R0402_15K_1%_0.0625W_100PPM: Resistor - 1%; Part Description: General Purpose Thick Film Chip Resistor; Manufacturer: GENERIC; Manufacturer1 Part Number: CRCW040215K0FK; TC: ±100ppm/°C; PressFit: No; Part Number: R0402_15K_1%_0.0625W_100PPM; Component Kind: Standard; Component Type: Standard; Pin Count: 2; Value: 15k; Status: None; Power: 0.0625W; Manufacturer Part Number: R0402_15K_1%_0.0625W_100PPM; Case: 0402; Mounted: Yes; Sense: No; Socket: No; SMD: Yes; Manufacturer1 Example: VISHAY; Manufacturer1 ComponentHeight: 0.4mm; HelpURL: \\cern.ch\dfs\Applications\Altium\Datasheets\R0402_VISHAY_CRCW e3.pdf; Author: CERN DEM JMW; CreateDate: 06.07.2015; LatestRevisionDate: 06.07.2015
R195 = R0402_1K3_1%_0.0625W_100PPM: Resistor - 1%; Part Description: General Purpose Thick Film Chip Resistor; Manufacturer: GENERIC; Manufacturer1 Part Number: 232270671302L; TC: ±100ppm/°C; PressFit: No; Part Number: R0402_1K3_1%_0.0625W_100PPM; Component Kind: Standard; Component Type: Standard; Pin Count: 2; Value: 1k3; Status: Not Recommended; Power: 0.0625W; Manufacturer Part Number: R0402_1K3_1%_0.0625W_100PPM; Case: 0402; Mounted: Yes; Sense: No; Socket: No; SMD: Yes; Manufacturer1 Example: YAGEO PHYCOMP; Manufacturer1 ComponentHeight: 0.4mm; HelpURL: \\cern.ch\dfs\Applications\Altium\Datasheets\R0402_Phycomp_RC0402.pdf; Author: CERN DEM JLC; CreateDate: 03.12.2007; LatestRevisionDate: 17.10.2012
R196 R234 R237 R381 = R0402_75K_1%_0.0625W_100PPM: Resistor - 1%; Part Description: General Purpose Thick Film Chip Resistor; Manufacturer: GENERIC; Manufacturer1 Part Number: 232270677503L; TC: ±100ppm/°C; PressFit: No; Part Number: R0402_75K_1%_0.0625W_100PPM; Component Kind: Standard; Component Type: Standard; Pin Count: 2; Value: 75k; Status: Not Recommended; Power: 0.0625W; Manufacturer Part Number: R0402_75K_1%_0.0625W_100PPM; Case: 0402; Mounted: Yes; Sense: No; Socket: No; SMD: Yes; Manufacturer1 Example: YAGEO PHYCOMP; Manufacturer1 ComponentHeight: 0.4mm; HelpURL: \\cern.ch\dfs\Applications\Altium\Datasheets\R0402_Phycomp_RC0402.pdf; Author: CERN DEM JLC
  R196: CreateDate: 03.12.2007; LatestRevisionDate: 17.10.2012
  R234 R237: Tolerance: ±1%; CreateDate: 03.12.2007; LatestRevisionDate: 17.10.2012
  R381: Tolerance: ±1%; CreateDate: 03/12/2007; LatestRevisionDate: 17/10/2012
R198 R294 = R0402_0R_JUMPER: Resistor; Part Description: 1A (0.05R Max DC Resistance) Zero Ohm Jumper; Manufacturer: GENERIC; Manufacturer1 Part Number: 232270591001L; PressFit: No; Part Number: R0402_0R_JUMPER; Component Kind: Standard; Component Type: Standard; Pin Count: 2; Value: 0; Status: Not Recommended; Manufacturer Part Number: R0402_0R_JUMPER; Case: 0402; Mounted: Yes; Sense: No; Socket: No; SMD: Yes; Manufacturer1 Example: YAGEO PHYCOMP; Manufacturer1 ComponentHeight: 0.4mm; HelpURL: \\cern.ch\dfs\Applications\Altium\Datasheets\R0402_Phycomp_RC0402.pdf; Author: CERN DEM JLC; CreateDate: 03.12.2007; LatestRevisionDate: 17.10.2012
R281 R282 = R0402_49R9_1%_0.0625W_100PPM: Resistor - 1%; Part Description: General Purpose Thick Film Chip Resistor; Manufacturer: GENERIC; Manufacturer1 Part Number: 232270674999L or RC0402FR-0749R9L; TC: ±100ppm/°C; PressFit: No; Part Number: R0402_49R9_1%_0.0625W_100PPM; Component Kind: Standard; Component Type: Standard; Pin Count: 2; Value: 49R9; Status: Not Recommended; Power: 0.0625W; Tolerance: ±1%; Manufacturer Part Number: R0402_49R9_1%_0.0625W_100PPM; Case: 0402; Mounted: Yes; Sense: No; Socket: No; SMD: Yes; Manufacturer1 Example: YAGEO PHYCOMP; Manufacturer1 ComponentHeight: 0.4mm; HelpURL: \\cern.ch\dfs\Applications\Altium\Datasheets\R0402_Phycomp_RC0402.pdf; Author: CERN DEM JLC; CreateDate: 24.10.2012; LatestRevisionDate: 24.10.2012
R305 R306 R318 = R0402_8K2_1%_0.0625W_100PPM: Resistor - 1%; Part Description: General Purpose Thick Film Chip Resistor; Manufacturer: GENERIC; Manufacturer1 Part Number: 232270678202L; TC: ±100ppm/°C; PressFit: No; Part Number: R0402_8K2_1%_0.0625W_100PPM; Component Kind: Standard; Component Type: Standard; Pin Count: 2; Value: 8k2; Status: Not Recommended; Power: 0.0625W; Tolerance: ±1%; Manufacturer Part Number: R0402_8K2_1%_0.0625W_100PPM; Case: 0402; Mounted: Yes; Sense: No; Socket: No; SMD: Yes; Manufacturer1 Example: YAGEO PHYCOMP; Manufacturer1 ComponentHeight: 0.4mm; HelpURL: \\cern.ch\dfs\Applications\Altium\Datasheets\R0402_Phycomp_RC0402.pdf; Author: CERN DEM JLC; CreateDate: 03.12.2007; LatestRevisionDate: 17.10.2012
R309-R312 R319 = R0402_10K_1%_0.0625W_100PPM: Resistor - 1%; Part Description: General Purpose Thick Film Chip Resistor; Manufacturer: GENERIC; Manufacturer1 Part Number: 232270671003L; TC: ±100ppm/°C; Part Number: R0402_10K_1%_0.0625W_100PPM; Component Kind: Standard; Component Type: Standard; Pin Count: 2; Value: 10k; Status: Not recommended; Power: 0.0625W; Tolerance: ±1%; Manufacturer Part Number: R0402_10K_1%_0.0625W_100PPM; Case: 0402; Mounted: Yes; Sense: No; Socket: No; SMD: Yes; Manufacturer1 Example: YAGEO PHYCOMP; Manufacturer1 ComponentHeight: 0.4mm; HelpURL: \\cern.ch\dfs\Applications\Altium\Datasheets\R0402_Phycomp_RC0402.pdf; Author: CERN DEM JLC; CreateDate: 03.12.2007; LatestRevisionDate: 17.10.2012
T3 T4 T19-T22 T24-T26 T29 = BSS138LT1G: N-CHANNEL MOSFET WITH DIODE; Part Description: 50V 200mA N-Channel Enhancement Mode Field-Effect Transistor; Manufacturer: ON SEMICONDUCTOR; PressFit: No; Bonding: No; Part Number: BSS138LT1G; Component Kind: Standard; Component Type: Standard; Device: BSS138LT1G; PackageDescription: SOT23 3-Leads, Pitch 0.95mm - Body 1.4x3mm, IPC Medium Density; Manufacturer Part Number: BSS138LT1G; Pin Count: 3; Case: SOT23-3; Mounted: Yes; Socket: No; SMD: Yes; Sense: No; ComponentHeight: 1.11mm; HelpURL: \\cern.ch\dfs\Applications\Altium\Datasheets\BSS138LT1G.pdf; Author: CERN DEM JLC; CreateDate: 23.03.2009; LatestRevisionDate: 23.03.2009
T5 T11 T12 = FDC606P: P-Channel 1.8V Specified PowerTrench MOSFET; Part Description: -12V -6A P-Channel 1.8V Specified PowerTrench® MOSFET; Manufacturer: ON SEMICONDUCTOR; PressFit: No; Bonding: No; Part Number: FDC606P; Component Kind: Standard; Component Type: Standard; Device: FDC606P; PackageDescription: SOT, 0.95mm Pitch; 6 Pin, 1.50mm W X 2.95mm L X 1.10mm H body, IPC Medium Density; Manufacturer Part Number: FDC606P; Pin Count: 6; Case: SOT23-6; Mounted: Yes; Socket: No; SMD: Yes; Sense: No; ComponentHeight: 1.1mm; HelpURL: \\cern.ch\dfs\Applications\Altium\Datasheets\FDC606P.pdf; Author: CERN DEM HF; CreateDate: 06.10.2021; LatestRevisionDate: 06.10.2021
T13 T14 T17 T27 = BC847B: NPN Transistor; Part Description: 45V 100mA NPN general-purpose transistors; Manufacturer: NXP SEMICONDUCTORS; PressFit: No; Bonding: No; Part Number: BC847B; Component Kind: Standard; Component Type: Standard; Device: BC847B; PackageDescription: SOT23, 3 pin, Pitch 0.95mm - 1.3mm W X 2.9mm L X 1.1mm H, IPC Medium Density; Manufacturer Part Number: BC847B; Pin Count: 3; Case: SOT23-3; Mounted: Yes; Socket: No; SMD: Yes; Sense: No; ComponentHeight: 1.1mm; HelpURL: \\cern.ch\dfs\Applications\Altium\Datasheets\BC847B.pdf; Author: CERN DEM JLC; CreateDate: 14.06.2011; LatestRevisionDate: 14.06.2011
TP5-TP8 TP10 TP14 TP15 TP20 TP23 TP24 = SMD_PAD_1.27X1.27MM: Part Description: 1.27mm x 1.27mm PCB Copper Area (SMD Test Point); Mounted: No; Part Number: SMD_PAD_1.27X1.27MM; Component Type: Standard (No BOM); Pin Count: 1; Family: Test Point; Socket: No; SMD: Yes; Sense: No; Status: None; ComponentHeight: 0mm; HelpURL: Undefined; Author: CERN DEM JLC; CreateDate: 12.01.2008; LatestRevisionDate: 12.01.2008; PackageDescription: 1.27mm x 1.27mm PCB Copper Area (SMD Test Point)